# Altium project Arrax_testbench.PrjPcb (part 1 of 2)
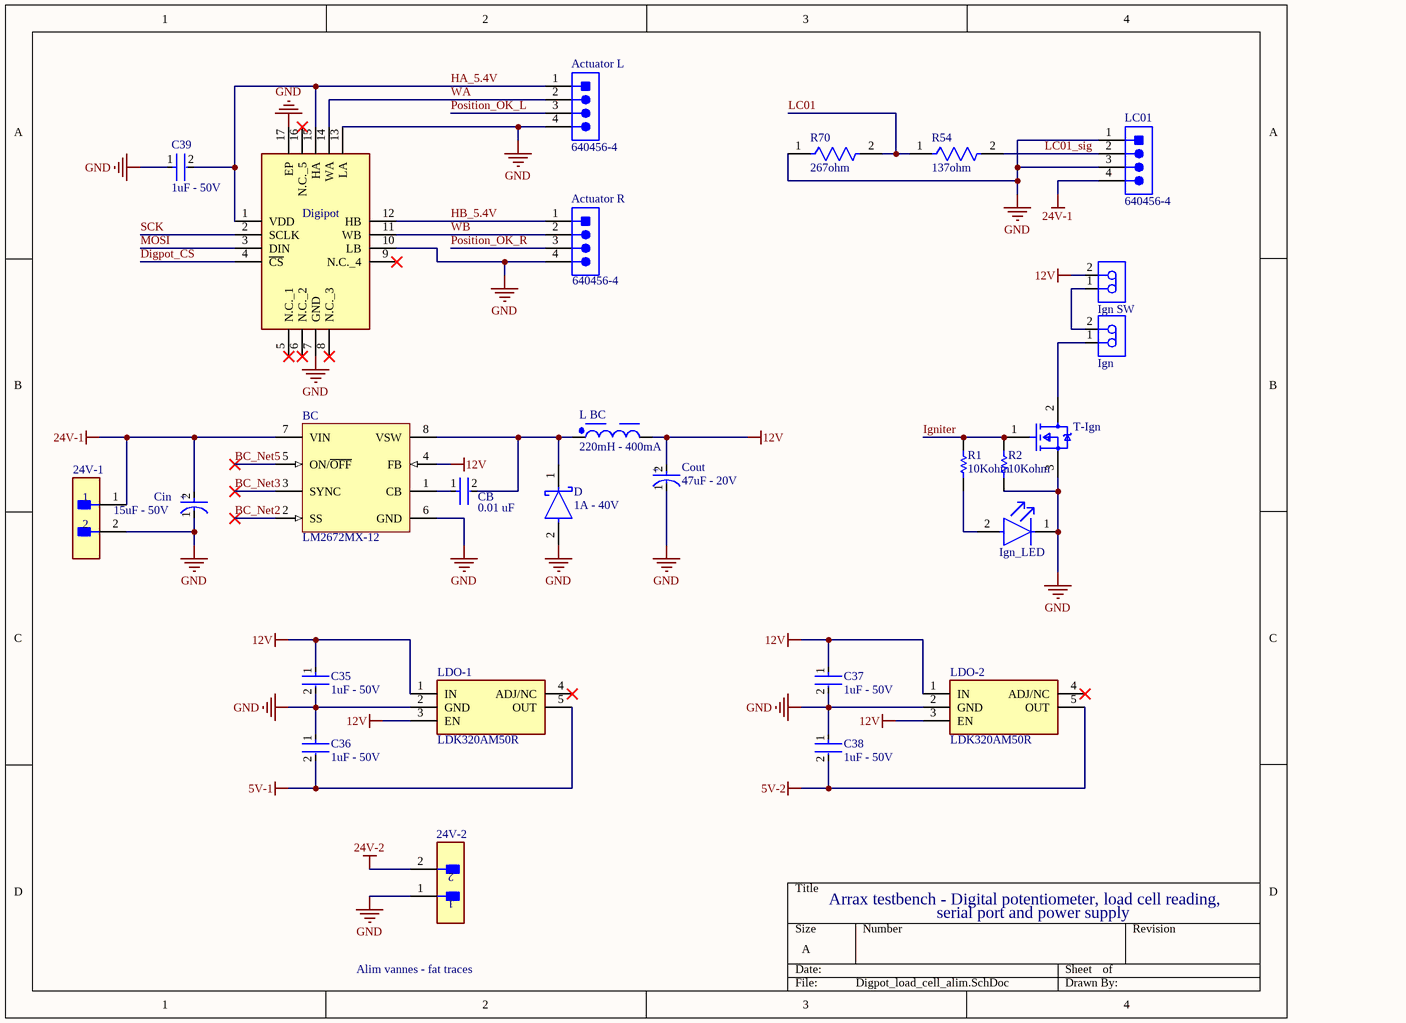
[diagram p0: Digpot_load_cell_alim.SchDoc]
7 sheets, 277 parts. Net scope: global (net labels, ports and power ports of the same name join across sheets).
Board file: Arrax_testbench_PCB_V1.PcbDoc
Sheets:
  Digpot_load_cell_alim.SchDoc
  Teensy_IOexp_valve_transitors.SchDoc
  Thermocouples.SchDoc
  Pressure_sensors.SchDoc
  Valve_transistors.SchDoc
  Thermocouples_1.SchDoc
  Flow_sensors.SchDoc

## Sheet Digpot_load_cell_alim.SchDoc
size A; SheetNumber: 1; SheetTotal: 7

### Parts
24V-1  (no value)  [FP-B2P-VH-FB-B_LF_SN-MFG]
24V-2  (no value)  [FP-B2P-VH-FB-B_LF_SN-MFG]
Actuator_L  640456-4  [TECO-640456-4]
Actuator_R  640456-4  [TECO-640456-4]
BC  LM2672MX-12  [M08A_L]
C35  1uF - 50V  [FP-0805-L_2_0_0_1-W_1_25-MFG]
C36  1uF - 50V  [FP-0805-L_2_0_0_1-W_1_25-MFG]
C37  1uF - 50V  [FP-0805-L_2_0_0_1-W_1_25-MFG]
C38  1uF - 50V  [FP-0805-L_2_0_0_1-W_1_25-MFG]
C39  1uF - 50V  [FP-0805-L_2_0_0_1-W_1_25-MFG]
CB  0.01 uF  [FP-CC0805-0_85-MFG]
Cin  15uF - 50V  [FP-TAJD-MFG]
Cout  47uF - 20V  [FP-TAJD-MFG]
D  1A - 40V  [FP-SOD-323-IPC_C]
Digipot  TPL0202-10MRTER  [QFN50P300X300X80-17N-D]  (value not drawn)
Ign  640456-2  [TECO-640456-2_V]  (value not drawn)
Ign_LED  LS R976-NR-1  [FP-LS_R976-MFG]  (value not drawn)
Ign_SW  640456-2  [TECO-640456-2_V]  (value not drawn)
L_BC  220mH - 400mA  [WE-LQFS_4828]
LC01  640456-4  [TECO-640456-4]
LDO-1  LDK320AM50R  [SOT95P280X145-5N]
LDO-2  LDK320AM50R  [SOT95P280X145-5N]
R1  10Kohm  [RESC2013X60X30NL20T20]
R2  10Kohm  [RESC2013X60X30NL20T20]
R54  137ohm  [FP-RP73P-2A-MFG]
R70  267ohm  [FP-RP73P-2A-MFG]
T-Ign  IRLZ44NPbF  [FP-PG-TO220-3-MFG]  (value not drawn)

### Nets
5V-1: C36.2 LDO-1.5(OUT)
5V-2: C38.2 LDO-2.5(OUT)
12V: BC.4(FB) C35.1 C37.1 Cout.2(A) Ign_SW.2 L_BC.2 LDO-1.1(IN) LDO-1.3(EN) LDO-2.1(IN) LDO-2.3(EN)
24V-1: 24V-1.1 BC.7(VIN) Cin.2(A) LC01.4
24V-2: 24V-2.2
GND: 24V-1.2 24V-2.1 Actuator_L.4 Actuator_R.4 BC.6(GND) C35.2 C36.1 C37.2 C38.1 C39.1 Cin.1(C) Cout.1(C) D.2(A) Digipot.7(GND) Digipot.10(LB) Digipot.13(LA) Digipot.17(EP) Ign_LED.1(C) LC01.1 LC01.3 LDO-1.2(GND) LDO-2.2(GND) R2.1 R70.1 T-Ign.3(S)
BC_Net2: BC.2(SS)
BC_Net3: BC.3(SYNC)
BC_Net5: BC.5(ON/~{OFF})
Digpot_CS: Digipot.4(~{CS})
HA_5.4V: Actuator_L.1 C39.2 Digipot.1(VDD) Digipot.15(HA)
HB_5.4V: Actuator_R.1 Digipot.12(HB)
Igniter: R1.2 R2.2 T-Ign.1(G)
LC01: R54.1 R70.2
LC01_sig: LC01.2 R54.2
MOSI: Digipot.3(DIN)
Position_OK_L: Actuator_L.3
Position_OK_R: Actuator_R.3
SCK: Digipot.2(SCLK)
WA: Actuator_L.2 Digipot.14(WA)
WB: Actuator_R.2 Digipot.11(WB)
NetBC_1: BC.1(CB) CB.1
NetBC_8: BC.8(VSW) CB.2 D.1(C) L_BC.1
NetIgn_1: Ign.1 T-Ign.2(D)
NetIgn_2: Ign.2 Ign_SW.1
NetIgn_LED_2: Ign_LED.2(A) R1.1

Not connected (* = marked no-connect by the designer): Digipot 5(N.C._1)* 6(N.C._2)* 8(N.C._3)* 9(N.C._4)* 16(N.C._5)*; LDO-1 4(ADJ/NC)*; LDO-2 4(ADJ/NC)*

### Notes on the sheet
- Arrax testbench - Digital potentiometer, load cell reading,
- Alim vannes - fat traces
- serial port and power supply
- (in symbol CMP-04424-000207-1) +
- (in symbol CMP-04424-000546-1) +

### Library data of the parts
24V-1 24V-2 = CMP-17439-000031-1: CONN HEADER VERT 2POS 3.96MM; Connector Type: Male Pin; Pitch: 0.156inch; Number of Positions: 2; Packaging: Bulk; Package Quantity: 250; Termination: Solder; Lead Free: Lead Free; Contact Plating: Tin; Contact Type: Male Pin; Color: Natural; Fastening Type: Ramp; Number of Rows: 1; Mount: Through Hole; Series: VH
Actuator_L Actuator_R LC01 = CMP-2000-05419-1: Male Header, Pitch 2.54 mm, 1 x 4 Position, Height 10.03 mm, Tail Length 3.56 mm, RoHS, Bulk; Manufacturer: TE Connectivity; Material, Housing: Polyester; Primary Type: InterconnectSystem; Mount Angle: Vertical; Color, Housing: White; Current, Rating: 5 / A; Agency Approvals: CSA,UL; Contact Termination Area Plating: Tin; Temperature, Operating: -55to+105 / degC; Standards: RoHSCompliant,ELVCompliant,UL94V-0; Number of Positions: 4; Brand/Series: MTA-100Series; Angle: Straight; Pin Spacing: 0.1 / "; Material, Contact: CopperAlloy; Connector Type: MTA-100; Special Features: Pinstrip; Mounting Hole Size: 0.04 / "; Contact Centerline Spacing: 0.100 / in.; Voltage, Rating: 250 / V; Manufacturer URL: http://www.te.com/; Length, Pin: 0.14 / "; Length, Overall: 0.4 / "; Color: White; Flammability Rating: UL94V-0; Mounting Type: PCMount; Termination: Solder; Datasheet URL: https://datasheet.ciiva.com/16286/eng-ds-82056-mta-0608-16286228.pdf; Number of Contacts: 4; Contact Shape: Square; Contact Mating Area Plating: Tin; Length, Terminal Post: 0.14 / in.; Size, Post: 0.025 / in.; Contact Plating: Tin; Type: PCBPlug; Datasheet Version: Dec-14; Number of Rows: 1
BC = CMP-0069-00660-2: SIMPLE SWITCHER® Power Converter High Efficiency 1A Step-Down Voltage Regulator with Features, 8-pin Narrow SOIC; Manufacturer: National Semiconductor; PackageTopMarking: NSZXTT*2672*M-12; PowerWise: N; ComponentLink2URL: http://www.national.com/pf/LM/LM2672.html; ComponentLink2Description: LM2672 Web Page; RoHS: N; PinCount: 8; Code_JEDEC: MS-012-AA; PackageDescription: SOIC Narrow, 4.9 x 3.9 x 1.45mm, 8 Lead, 1.27mm Pitch; PackageReference: M08A; ComponentLink3Description: M08A Package Page; RevisionNote: Component URLs added; Code_IPC: SOIC127P600-8; PackageVersion: revM, May-2009; ComponentLink1URL: http://www.national.com/ds/LM/LM2672.pdf; DatasheetVersion: Apr-2007; ComponentLink3URL: http://www.national.com/packaging/folders/m08a.html; ComponentLink1Description: LM2672 Datasheet; CompType: Switcher
C35-C39 = CMP-14477-005239-2: Multilayer Ceramic Capacitor 1 uF 50V X7R 10% SMD 0805 Automotive T/R; Packaging: Tape and Reel; Width: 1.2mm; Height: 1.25mm; Package Quantity: 3000; Min Operating Temperature: -55°C; Thickness: 0.053inch; Case/Package: 0805; Weight: 0.000194oz; Dielectric: X7R; Halogen Free: Halogen Free; Tolerance: 10%; Ratings: AEC-Q200; RoHS Compliant: Yes; Voltage Rating (DC): 50V; Capacitance: 1uF; Series: M; Length: 2mm; Mount: Surface Mount; Max Operating Temperature: 125°C; Voltage Rating: 50V; Case Code (Imperial): 0805; Case Code (Metric): 2012; Termination: SMD/SMT
CB = CMP-1036-03842-3: CAP CER 10000PF 50V X7R 0805; Manufacturer: Yageo; Manufacturer Part Number: CC0805KRX7R9BB103; Capacitance: 10 nF; Value: 10 nF; Tolerance: 0.1; Footprint Url: http://www.yageo.com/exep/pages/download/literatures/UPY-C_GEN_24.pdf; Material: Ceramic; Temperature Characteristic: X7R; ComponentLink2Description: Datasheet; Lead Free: Yes; Height: 0.95mm; Temperature Range High: +85°C; Automotive: No; Octopart: https://octopart.com/cc0805krx7r9bb103-yageo-192989; Device Class L1: Passive Components; Mouser Description: Multilayer Ceramic Capacitors MLCC - SMD/SMT 10nF 50V X7R 10%; Temperature: -30°C to +85°C; Device Class L2: Capacitors; Ipc Land Pattern Name: CAPC200125X85; Device Class L3: Ceramic Capacitors; Temperature Range Low: -30°C; RoHS: TRUE; Voltage Rating: 50 V; Package: CC0805-0.85; Category: Cap; ComponentLink2URL: http://www.yageo.com/documents/recent/UPY-GPHC_Y5V_6.3V-to-50V_8.pdf; Digikey Description: CAP CER 10000PF 50V X7R 0805
Cin = CMP-04424-000546-1: 15uF 50V  ±10% 600mΩ 2917  SMD Tantalum Capacitor; Leakage Current: 7.5uA; ESR (Equivalent Series Resistance): 600mR; Dissipation Factor: 6%; Polarity: Polar; RoHS Compliant: Yes; Packaging: Tape and Reel; Features: General Purpose; Dielectric Material: Tantalum; Case/Package: 2917; Case Code (Imperial): 2917; Max Operating Temperature: 125°C; Construction: Flat; Width: 0.169inch; Height - Seated (Max): 0.122inch; Lead Free: Lead Free; Capacitance: 15uF; Mount: Surface Mount; Depth: 4.3mm; Series: TAJ; Case Code (Metric): 7343; Voltage Rating: 50V; Termination: SMD/SMT; Min Operating Temperature: -55°C; Tolerance: 10%; Package Quantity: 500; Radiation Hardening: No; Height: 3.1mm; Length: 7.3mm; REACH SVHC: No SVHC; Lead Pitch: 4.4mm
Cout = CMP-04424-000207-1: 47uF 20V  ±10% 900mΩ 2917  SMD Tantalum Capacitor; Leakage Current: 9.4uA; Dissipation Factor: 6%; ESR (Equivalent Series Resistance): 900mR; Polarity: Polar; Width: 4.3mm; REACH SVHC: No SVHC; Voltage Rating (DC): 20V; RoHS Compliant: Yes; Height: 2.9mm; Case Code (Metric): 7343; Case Code (Imperial): 2917; Length: 7.3mm; Packaging: Tape and Reel; Series: TAJ; Lead Free: Lead Free; Voltage Rating: 20V; Max Operating Temperature: 125°C; Package Quantity: 1; Case/Package: 2917; Capacitance: 47uF; Tolerance: 10%; Dielectric Material: Tantalum; Depth: 4.3mm; Features: General Purpose; Min Operating Temperature: -55°C; Radiation Hardening: No; Height - Seated (Max): 0.122inch; Mount: Surface Mount; Voltage: 20V; Construction: Flat; Termination: SMD/SMT
D = CMP-56206-000009-1: DIODE SCHOTTKY 40V 1A SOD323; Max Reverse Leakage Current: 1mA; Peak Non-Repetitive Surge Current: 10A; Forward Voltage: 900mV; Element Configuration: Single; Max Reverse Voltage (DC): 40V; Number of Pins: 2; Max Operating Temperature: 125°C; Package Quantity: 1; Radiation Hardening: No; Average Rectified Current: 1A; Lead Free: Lead Free; Series: -; Mount: Surface Mount; Min Operating Temperature: -65°C; RoHS Compliant: Yes; Packaging: Tape and Reel; Max Surge Current: 10A
Digipot = TPL0202-10MRTER: Integrated Circuit; Manufacturer_Name: Texas Instruments; Datasheet Link: http://www.ti.com/lit/gpn/tpl0202-10; Height: 0.8mm; Manufacturer_Part_Number: TPL0202-10MRTER; Mouser Part Number: 595-TPL0202-10MRTER; Mouser Price/Stock: https://www.mouser.co.uk/ProductDetail/Texas-Instruments/TPL0202-10MRTER?qs=O1HRStiETCjiIaUc6hg4xg%3D%3D; Arrow Part Number: TPL0202-10MRTER; Arrow Price/Stock: https://www.arrow.com/en/products/tpl0202-10mrter/texas-instruments
Ign Ign_SW = CMP-2000-05417-1: Male Header, Pitch 2.54 mm, 1 x 2 Position, Height 10.49 mm, Tail Length 3.556 mm, -55 to 105 degC, RoHS, Bulk; Manufacturer: TE Connectivity; Standards: RoHSCompliant,ELVCompliant,UL94V-0; Material, Housing: Polyester; Agency Approvals: CSA,UL; Brand/Series: MTA-100Series; Contact Centerline Spacing: 0.100 / in.; Material, Contact: CopperAlloy; Current, Rating: 5 / A; Color, Housing: White; Contact Termination Area Plating: Tin; Special Features: Pinstrip; Number of Positions: 2; Pin Spacing: 0.1 / "; Temperature, Operating: -55to+105 / degC; Angle: Straight; Mount Angle: Vertical; Connector Type: MTA-100; Primary Type: InterconnectSystem; Voltage, Rating: 250 / V; Mounting Hole Size: 0.04 / "; Number of Rows: 1; Termination: Solder; Length, Terminal Post: 0.14 / in.; Manufacturer URL: http://www.te.com/; Color: White; Size, Post: 0.025 / in.; Contact Shape: Square; Mounting Type: PCMount; Datasheet URL: https://datasheet.ciiva.com/11746/0900766b80eb7fdd-11746365.pdf; Type: PCBPlug; Datasheet Version: Rev. W, 06/2004; Number of Contacts: 2; Flammability Rating: UL94V-0; Contact Plating: Tin; Length, Pin: 0.14 / "; Contact Mating Area Plating: Tin; Length, Overall: 0.2 / "
Ign_LED = CMP-62016-000037-1: LED RED DIFFUSED 0805 SMD; Lens Size: 1.25mm; Number of LEDs: 1; Luminous Intensity: 180mcd; Dominant Wavelength: 633nm; Lens Style: Flat; Reverse Voltage: 12V; Lens Color: White; Forward Voltage: 2.5V; Forward Current: 25mA; Power Dissipation: 65W; Luminous Flux: 0.47lm; Test Current: 20mA; Viewing Angle: 160°; Length: 2mm; Number of Pins: 2; Lens Transparency: Diffused; Min Operating Temperature: -30°C; Case Code (Metric): 2012; Depth: 1.35mm; Color: Red; Illumination Color: Red; Max Operating Temperature: 85°C; Mount: Surface Mount; Case/Package: 0805; Height: 0.9mm; Package Quantity: 16000; Number of Elements: 1; Radiation Hardening: No; Case Code (Imperial): 0805; Packaging: Tape and Reel; Width: 1.25mm
L_BC = CMP-03913-77814927-1: 74406043221 Fixed Ind 220UH 400MA 1.326 Ohm; DC Resistance (DCR): 1.105Ω; Inductance Tolerance: 20%; Inductance: 220µH; RoHS: Compliant; Ambient Temperature Range High: 85°C; Ambient Temperature Range Low: -40°C; Min Operating Temperature: -40°C; Length: 4.8mm; Current Rating: 400mA; NexarPartId: 77814927; Height: 2.8mm; Width: 4.8mm; Max Operating Temperature: 125°C
LDO-1 LDO-2 = LDK320AM50R: Integrated Circuit; Manufacturer_Name: STMicroelectronics; Datasheet Link: http://www.st.com/resource/en/datasheet/ldk320.pdf; Height: 1.45mm; Manufacturer_Part_Number: LDK320AM50R; Mouser Part Number: 511-LDK320AM50R; Mouser Price/Stock: https://www.mouser.co.uk/ProductDetail/STMicroelectronics/LDK320AM50R?qs=dTJS0cRn7ohMsVcu3TlL4w%3D%3D; Arrow Part Number: LDK320AM50R; Arrow Price/Stock: https://www.arrow.com/en/products/ldk320am50r/stmicroelectronics?region=nac
R1 R2 = CMP-2001-01994-1: Manufacturer: KOA Speer; Part Number: RK73H2ATTD1003F
R54 = CMP-03211-001043-1: RP73P 0805 137Ω 0.25W 25ppm/°C 0.10% 150V; Manufacturer Part Number: RP73PF2A137RBTDF; Manufacturer: TE Connectivity; Tolerance: 0.001; Temperature Coefficient: 25ppm/°C; Composition: Thin Film; Temperature Range High: +155°C; Automotive: No; Ipc Land Pattern Name: RESC200125X55; Lead Free: Yes; Device Class L2: Resistors; Temperature: -55°C to +155°C; Resistance: 137Ω; Series: RP73P; Category: Res; Temperature Range Low: -55°C; RoHS: TRUE; Voltage Rating: 150V; Value: 137Ω; Height: 0.65mm; ComponentLink2URL: https://www.te.com/commerce/DocumentDelivery/DDEController?Action=srchrtrv&DocNm=1773272&DocType=DS&DocLang=English; Package: RP73P-2A; Power Rating: 0.25W; ComponentLink2Description: Datasheet; Device Class L1: Passive Components; Device Class L3: Chip SMD Resistors; Octopart: https://octopart.com/rp73pf2a137rbtdf-te+connectivity-45466427
R70 = CMP-03211-003395-1: RP73P 0805 267Ω 0.25W 25ppm/°C 0.10% 150V; Manufacturer Part Number: RP73PF2A267RBTDF; Manufacturer: TE Connectivity; Tolerance: 0.001; RoHS: TRUE; Composition: Thin Film; Device Class L1: Passive Components; Temperature Coefficient: 25ppm/°C; Height: 0.65mm; Temperature Range Low: -55°C; Category: Res; Temperature Range High: +155°C; Value: 267Ω; Device Class L2: Resistors; Lead Free: Yes; ComponentLink2Description: Datasheet; ComponentLink2URL: https://www.te.com/commerce/DocumentDelivery/DDEController?Action=srchrtrv&DocNm=1773272&DocType=DS&DocLang=English; Device Class L3: Chip SMD Resistors; Voltage Rating: 150V; Power Rating: 0.25W; Automotive: No; Series: RP73P; Ipc Land Pattern Name: RESC200125X55; Package: RP73P-2A; Temperature: -55°C to +155°C; Octopart: https://octopart.com/rp73pf2a267rbtdf-te+connectivity-45466701; Resistance: 267Ω
T-Ign = CMP-32901-000488-1: MOSFET N-CH 55V 47A TO220AB; Turn-On Delay Time: 11ns; Gate to Source Voltage (Vgs): 16V; Element Configuration: Single; Rds On Max: 22mR; Turn-Off Delay Time: 26ns; Max Power Dissipation: 110W; Threshold Voltage: 2V; Drain to Source Resistance: 35mR; Input Capacitance: 1.7nF; Continuous Drain Current (ID): 47A; Case/Package: TO-220; Lead Free: Lead Free; Halogen Free: Halogen Free; Packaging: Rail/Tube; Length: 0.414inch; Min Operating Temperature: -55°C; REACH SVHC: No SVHC; Number of Pins: 3; Width: 0.185inch; Drain to Source Voltage (Vdss): 55V; Power Dissipation: 110W; RoHS Compliant: Yes; Max Operating Temperature: 175°C; Height: 0.6inch; Max Dual Supply Voltage: 55V; Drain to Source Breakdown Voltage: 55V; Mount: Through Hole

## Sheet Teensy_IOexp_valve_transitors.SchDoc
size A; SheetNumber: 2; SheetTotal: 7
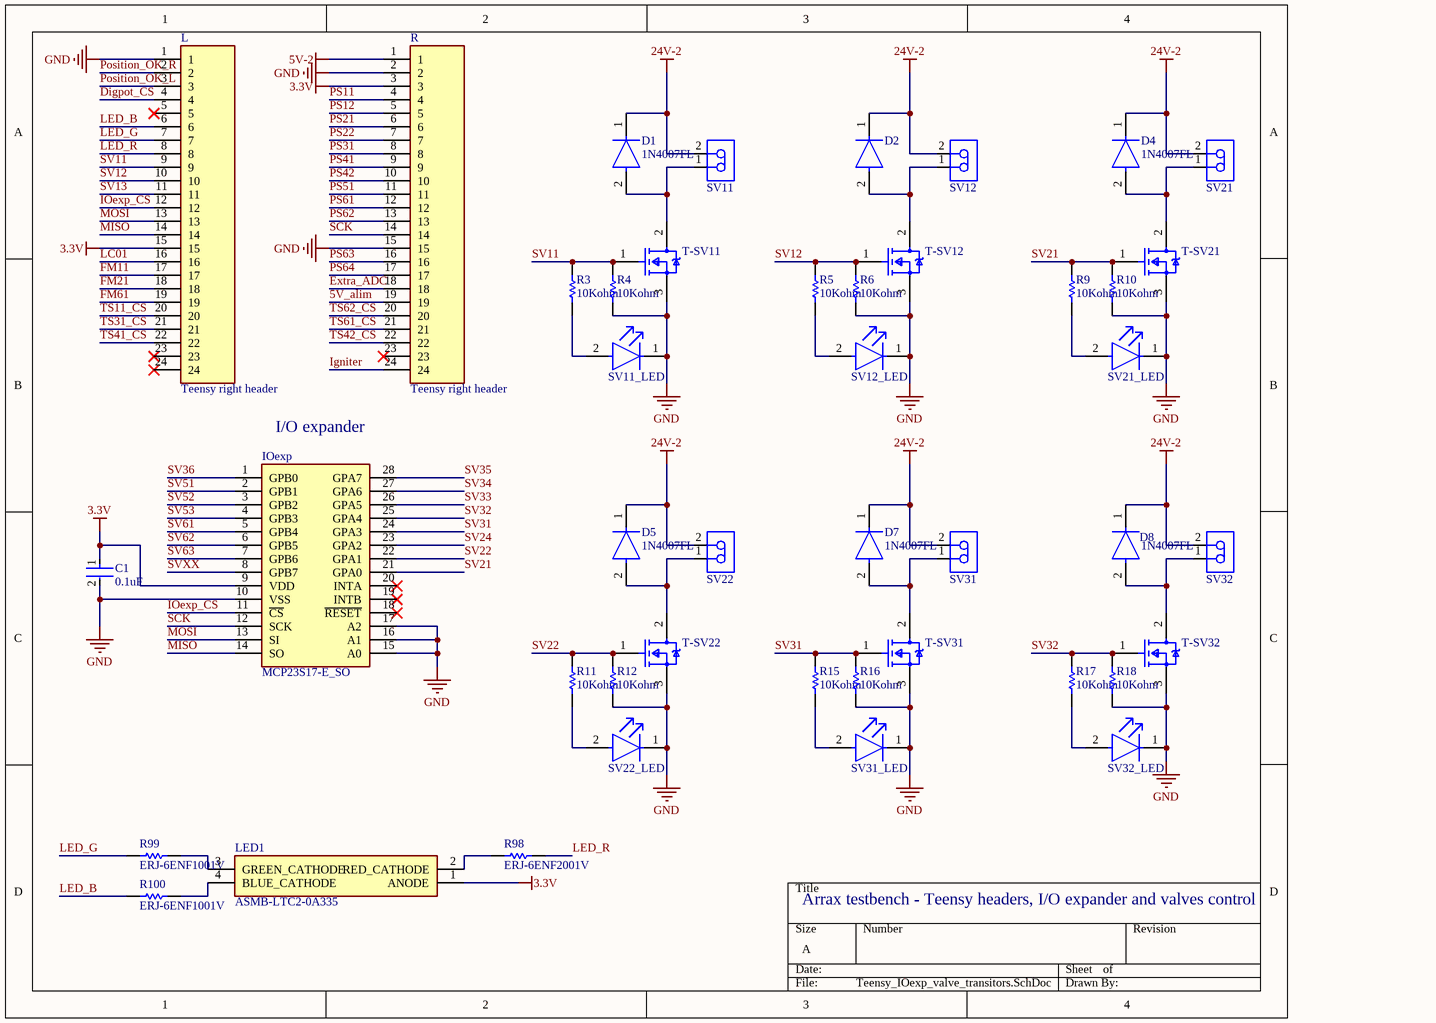
[diagram p1: Teensy_IOexp_valve_transitors.SchDoc]

### Parts
C1  0.1uF  [FP-CC0805-0_85-MFG]
D1  1N4007FL  [FP-1N4007FL-MFG]
D2  1N4007FL  [FP-1N4007FL-MFG]  (value not drawn)
D4  1N4007FL  [FP-1N4007FL-MFG]
D5  1N4007FL  [FP-1N4007FL-MFG]
D7  1N4007FL  [FP-1N4007FL-MFG]
D8  1N4007FL  [FP-1N4007FL-MFG]
IOexp  MCP23S17-E_SO  [SOIC127P1030X265-28N]
L  Teensy right header  [RHDR24W80P254X254_1X24_6146X254X850P]
LED1  ASMB-LTC2-0A335  [ASMBLTC20A335]
R  Teensy right header  [RHDR24W80P254X254_1X24_6146X254X850P]
R3  10Kohm  [RESC2013X60X30NL20T20]
R4  10Kohm  [RESC2013X60X30NL20T20]
R5  10Kohm  [RESC2013X60X30NL20T20]
R6  10Kohm  [RESC2013X60X30NL20T20]
R9  10Kohm  [RESC2013X60X30NL20T20]
R10  10Kohm  [RESC2013X60X30NL20T20]
R11  10Kohm  [RESC2013X60X30NL20T20]
R12  10Kohm  [RESC2013X60X30NL20T20]
R15  10Kohm  [RESC2013X60X30NL20T20]
R16  10Kohm  [RESC2013X60X30NL20T20]
R17  10Kohm  [RESC2013X60X30NL20T20]
R18  10Kohm  [RESC2013X60X30NL20T20]
R98  ERJ-6ENF2001V  [RESC2013X70X40NL20T20]
R99  ERJ-6ENF1001V  [RESC2013X70X40ML20T20]
R100  ERJ-6ENF1001V  [RESC2013X70X40ML20T20]
SV11  640456-2  [TECO-640456-2_V]  (value not drawn)
SV11_LED  LS R976-NR-1  [FP-LS_R976-MFG]  (value not drawn)
SV12  640456-2  [TECO-640456-2_V]  (value not drawn)
SV12_LED  LS R976-NR-1  [FP-LS_R976-MFG]  (value not drawn)
SV21  640456-2  [TECO-640456-2_V]  (value not drawn)
SV21_LED  LS R976-NR-1  [FP-LS_R976-MFG]  (value not drawn)
SV22  640456-2  [TECO-640456-2_V]  (value not drawn)
SV22_LED  LS R976-NR-1  [FP-LS_R976-MFG]  (value not drawn)
SV31  640456-2  [TECO-640456-2_V]  (value not drawn)
SV31_LED  LS R976-NR-1  [FP-LS_R976-MFG]  (value not drawn)
SV32  640456-2  [TECO-640456-2_V]  (value not drawn)
SV32_LED  LS R976-NR-1  [FP-LS_R976-MFG]  (value not drawn)
T-SV11  IRLZ44NPbF  [FP-PG-TO220-3-MFG]  (value not drawn)
T-SV12  IRLZ44NPbF  [FP-PG-TO220-3-MFG]  (value not drawn)
T-SV21  IRLZ44NPbF  [FP-PG-TO220-3-MFG]  (value not drawn)
T-SV22  IRLZ44NPbF  [FP-PG-TO220-3-MFG]  (value not drawn)
T-SV31  IRLZ44NPbF  [FP-PG-TO220-3-MFG]  (value not drawn)
T-SV32  IRLZ44NPbF  [FP-PG-TO220-3-MFG]  (value not drawn)

### Nets
3.3V: C1.1 IOexp.9(VDD) L.15 LED1.1(ANODE) R.3
5V-2: R.1
24V-2: D1.1(C) D2.1(C) D4.1(C) D5.1(C) D7.1(C) D8.1(C) SV11.2 SV12.2 SV21.2 SV22.2 SV31.2 SV32.2
GND: C1.2 IOexp.10(VSS) IOexp.15(A0) IOexp.16(A1) IOexp.17(A2) L.1 R.2 R.15 R4.1 R6.1 R10.1 R12.1 R16.1 R18.1 SV11_LED.1(C) SV12_LED.1(C) SV21_LED.1(C) SV22_LED.1(C) SV31_LED.1(C) SV32_LED.1(C) T-SV11.3(S) T-SV12.3(S) T-SV21.3(S) T-SV22.3(S) T-SV31.3(S) T-SV32.3(S)
5V_alim: R.19
Digpot_CS: L.4
Extra_ADC: R.18
FM11: L.17
FM21: L.18
FM61: L.19
Igniter: R.24
IOexp_CS: IOexp.11(~{CS}) L.12
LC01: L.16
LED_B: L.6 R100.1
LED_G: L.7 R99.1
LED_R: L.8 R98.2
MISO: IOexp.14(SO) L.14
MOSI: IOexp.13(SI) L.13
Position_OK_L: L.3
Position_OK_R: L.2
PS11: R.4
PS12: R.5
PS21: R.6
PS22: R.7
PS31: R.8
PS41: R.9
PS42: R.10
PS51: R.11
PS61: R.12
PS62: R.13
PS63: R.16
PS64: R.17
SCK: IOexp.12(SCK) R.14
SV11: L.9 R3.2 R4.2 T-SV11.1(G)
SV12: L.10 R5.2 R6.2 T-SV12.1(G)
SV13: L.11
SV21: IOexp.21(GPA0) R9.2 R10.2 T-SV21.1(G)
SV22: IOexp.22(GPA1) R11.2 R12.2 T-SV22.1(G)
SV24: IOexp.23(GPA2)
SV31: IOexp.24(GPA3) R15.2 R16.2 T-SV31.1(G)
SV32: IOexp.25(GPA4) R17.2 R18.2 T-SV32.1(G)
SV33: IOexp.26(GPA5)
SV34: IOexp.27(GPA6)
SV35: IOexp.28(GPA7)
SV36: IOexp.1(GPB0)
SV51: IOexp.2(GPB1)
SV52: IOexp.3(GPB2)
SV53: IOexp.4(GPB3)
SV61: IOexp.5(GPB4)
SV62: IOexp.6(GPB5)
SV63: IOexp.7(GPB6)
SVXX: IOexp.8(GPB7)
TS11_CS: L.20
TS31_CS: L.21
TS41_CS: L.22
TS42_CS: R.22
TS61_CS: R.21
TS62_CS: R.20
NetD1_2: D1.2(A) SV11.1 T-SV11.2(D)
NetD2_2: D2.2(A) SV12.1 T-SV12.2(D)
NetD4_2: D4.2(A) SV21.1 T-SV21.2(D)
NetD5_2: D5.2(A) SV22.1 T-SV22.2(D)
NetD7_2: D7.2(A) SV31.1 T-SV31.2(D)
NetD8_2: D8.2(A) SV32.1 T-SV32.2(D)
NetLED1_2: LED1.2(RED_CATHODE) R98.1
NetLED1_3: LED1.3(GREEN_CATHODE) R99.2
NetLED1_4: LED1.4(BLUE_CATHODE) R100.2
NetR3_1: R3.1 SV11_LED.2(A)
NetR5_1: R5.1 SV12_LED.2(A)
NetR9_1: R9.1 SV21_LED.2(A)
NetR11_1: R11.1 SV22_LED.2(A)
NetR15_1: R15.1 SV31_LED.2(A)
NetR17_1: R17.1 SV32_LED.2(A)

Not connected (* = marked no-connect by the designer): IOexp 18(~{RESET})* 19(INTB)* 20(INTA)*; L 5* 23* 24*; R 23*

### Notes on the sheet
- I/O expander
- Arrax testbench - Teensy headers, I/O expander and valves control

### Library data of the parts
C1 = CMP-2100-03606-3: CAP CER 0.1UF 50V X7R 0805; Manufacturer Part Number: CC0805KRX7R9BB104; Manufacturer: Yageo; Tolerance: 0.1; Capacitance: 100 nF; Value: 100 nF; Material: Ceramic; Device Class L1: Passive Components; ComponentLink2Description: Datasheet; Package: CC0805-0.85; Digikey Description: CAP CER 0.1UF 50V X7R 0805; Device Class L3: Ceramic Capacitors; Temperature: -30°C to +85°C; Temperature Characteristic: X7R; Voltage Rating: 50 V; Height: 0.95mm; RoHS: TRUE; Ipc Land Pattern Name: CAPC200125X85; Device Class L2: Capacitors; Category: Cap; Temperature Range Low: -30°C; Temperature Range High: +85°C; Mouser Description: Multilayer Ceramic Capacitors MLCC - SMD/SMT 100nF 50V X7R 10%; Footprint Url: http://www.yageo.com/exep/pages/download/literatures/UPY-C_GEN_24.pdf; Automotive: No; Octopart: https://octopart.com/cc0805krx7r9bb104-yageo-192993; Lead Free: Yes; ComponentLink2URL: http://www.yageo.com/documents/recent/UPY-GPHC_Y5V_6.3V-to-50V_8.pdf
D1 D2 D4 D5 D7 D8 = CMP-10078-122641204-1: 1N4007FL Diode Gen Purp 1KV 1A SOD123FL; Capacitance: 6pF; Max Junction Temperature (Tj): 150°C; Peak Reverse Current: 5µA; Max Forward Surge Current (Ifsm): 30A; Reverse Voltage: 1kV; Max Operating Temperature: 150°C; Height: 1.1mm; Min Operating Temperature: -55°C; Forward Current: 1A; Max Repetitive Reverse Voltage (Vrrm): 1kV; NexarPartId: 122641204
IOexp = MCP23S17-E_SO: Integrated Circuit; Manufacturer_Name: Microchip; Manufacturer_Part_Number: MCP23S17-E/SO; Datasheet Link: https://datasheet.datasheetarchive.com/originals/distributors/SFDatasheet-4/sf-00090057.pdf; Height: 2.65mm; Mouser Part Number: 579-MCP23S17-E/SO; Mouser Price/Stock: https://www.mouser.co.uk/ProductDetail/Microchip-Technology/MCP23S17-E-SO?qs=usxtMOJb1RzJScThsWtScg%3D%3D; Arrow Part Number: MCP23S17-E/SO; Arrow Price/Stock: https://www.arrow.com/en/products/mcp23s17-eso/microchip-technology?region=europe
L R = PPTC241LFBN-RC: Connector; Manufacturer_Name: Sullins; Datasheet Link: https://drawings-pdf.s3.amazonaws.com/10492.pdf; Height: 8.5mm; Manufacturer_Part_Number: PPTC241LFBN-RC
LED1 = ASMB-LTC2-0A335: LED; Manufacturer_Name: Avago Technologies; Datasheet Link: https://datasheet.datasheetarchive.com/originals/distributors/Datasheets_SAMA/7bf4059288332b456b15eab80a49c995.pdf; Height: 1.2mm; Manufacturer_Part_Number: ASMB-LTC2-0A335
R3-R6 R9-R12 R15-R18 = CMP-2001-01994-1: as R1 on sheet Digpot_load_cell_alim
R98 = CMP-2001-00026-5: Chip Resistor, 2 KOhm, +/- 1%, 0.125 W, -55 to 155 degC, 0805 (2012 Metric), RoHS, Tape and Reel; Manufacturer: Panasonic; Voltage Rating: 150 V; RoHSCompliant: true; Packaging: Tape and Reel; ComponentLink2Description: Datasheet; DatasheetVersion: 04/2015; Min Operating Temperature: -55 degC; Max Operating Temperature: 155 degC; Mounting Technology: Surface Mount; Length: 2 mm; Package Quantity: 5000; REACH SVHC: Unknown; ComponentLink1URL: http://www.panasonic.com/; ComponentLink2URL: http://industrial.panasonic.com/cdbs/www-data/pdf/RDA0000/AOA0000C86.pdf; Mount: Surface Mount; PackageReference: 0805; ComponentLink1Description: Manufacturer URL; PackageDescription: 2-Pin Surface Mount Device, Body 2 x 1.25 mm; Height: 0.6 mm
R99 R100 = CMP-2001-04375-5: Chip Resistor, 1 KOhm, +/- 1%, 0.125 W, -55 to 155 degC, 0805 (2012 Metric), RoHS, Tape and Reel; Manufacturer: Panasonic; Voltage Rating: 150 V; ComponentLink1URL: http://www.panasonic.com/; ComponentLink2Description: Datasheet; REACH SVHC: Yes; ComponentLink1Description: Manufacturer URL; Length: 2 mm; Height: 0.6 mm; Package Quantity: 1; PackageDescription: 2-Pin Surface Mount Device, Body 2 x 1.25 mm; Packaging: Cut Tape; PackageReference: 0805; Max Operating Temperature: 155 degC; Mounting Technology: Surface Mount; ComponentLink2URL: http://industrial.panasonic.com/cdbs/www-data/pdf/RDA0000/AOA0000C86.pdf; DatasheetVersion: 04/2015; Min Operating Temperature: -55 degC; RoHSCompliant: true; Mount: Surface Mount
SV11 SV12 SV21 SV22 SV31 SV32 = CMP-2000-05417-1: as Ign on sheet Digpot_load_cell_alim; Number of Rows: 1; Termination: Solder; Length, Terminal Post: 0.14 / in.; Manufacturer URL: http://www.te.com/; Color: White; Size, Post: 0.025 / in.; Contact Shape: Square; Mounting Type: PCMount; Datasheet URL: https://datasheet.ciiva.com/11746/0900766b80eb7fdd-11746365.pdf; Type: PCBPlug; Datasheet Version: Rev. W, 06/2004; Number of Contacts: 2; Flammability Rating: UL94V-0; Contact Plating: Tin; Length, Pin: 0.14 / "; Contact Mating Area Plating: Tin; Length, Overall: 0.2 / "
SV11_LED SV12_LED SV21_LED SV22_LED SV31_LED SV32_LED = CMP-62016-000037-1: as Ign_LED on sheet Digpot_load_cell_alim; Length: 2mm; Number of Pins: 2; Lens Transparency: Diffused; Min Operating Temperature: -30°C; Case Code (Metric): 2012; Depth: 1.35mm; Color: Red; Illumination Color: Red; Max Operating Temperature: 85°C; Mount: Surface Mount; Case/Package: 0805; Height: 0.9mm; Package Quantity: 16000; Number of Elements: 1; Radiation Hardening: No; Case Code (Imperial): 0805; Packaging: Tape and Reel; Width: 1.25mm
T-SV11 T-SV12 T-SV21 T-SV22 T-SV31 T-SV32 = CMP-32901-000488-1: as T-Ign on sheet Digpot_load_cell_alim; Continuous Drain Current (ID): 47A; Case/Package: TO-220; Lead Free: Lead Free; Halogen Free: Halogen Free; Packaging: Rail/Tube; Length: 0.414inch; Min Operating Temperature: -55°C; REACH SVHC: No SVHC; Number of Pins: 3; Width: 0.185inch; Drain to Source Voltage (Vdss): 55V; Power Dissipation: 110W; RoHS Compliant: Yes; Max Operating Temperature: 175°C; Height: 0.6inch; Max Dual Supply Voltage: 55V; Drain to Source Breakdown Voltage: 55V; Mount: Through Hole

## Sheet Thermocouples.SchDoc
size A; SheetNumber: 3; SheetTotal: 7
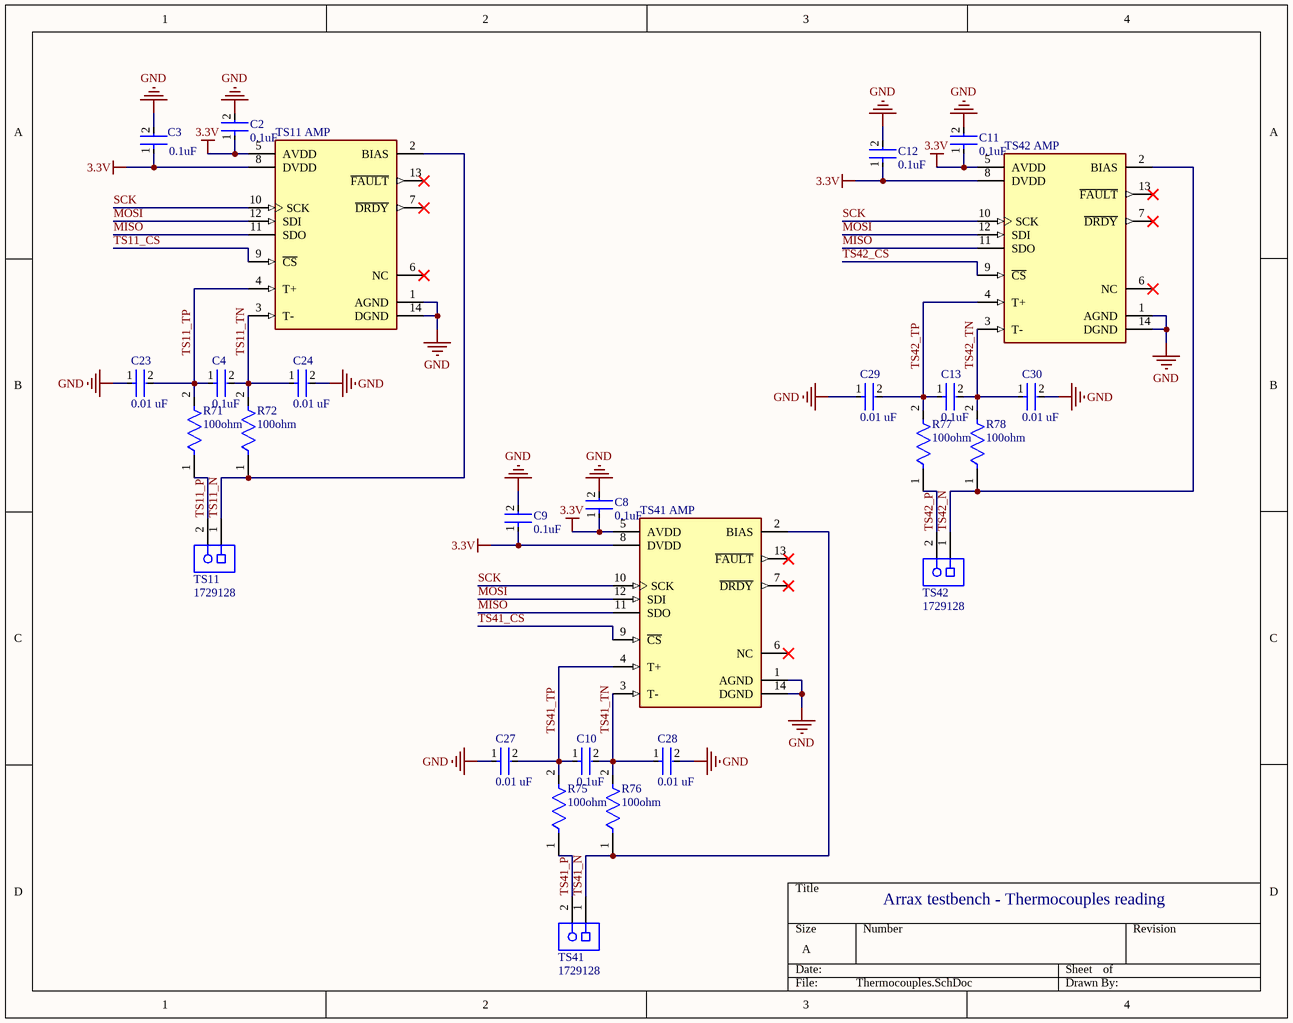
[diagram p2: Thermocouples.SchDoc]

### Parts
C2  0.1uF  [FP-CC0805-0_85-MFG]
C3  0.1uF  [FP-CC0805-0_85-MFG]
C4  0.1uF  [FP-CC0805-0_85-MFG]
C8  0.1uF  [FP-CC0805-0_85-MFG]
C9  0.1uF  [FP-CC0805-0_85-MFG]
C10  0.1uF  [FP-CC0805-0_85-MFG]
C11  0.1uF  [FP-CC0805-0_85-MFG]
C12  0.1uF  [FP-CC0805-0_85-MFG]
C13  0.1uF  [FP-CC0805-0_85-MFG]
C23  0.01 uF  [FP-CC0805-0_85-MFG]
C24  0.01 uF  [FP-CC0805-0_85-MFG]
C27  0.01 uF  [FP-CC0805-0_85-MFG]
C28  0.01 uF  [FP-CC0805-0_85-MFG]
C29  0.01 uF  [FP-CC0805-0_85-MFG]
C30  0.01 uF  [FP-CC0805-0_85-MFG]
R71  100ohm  [FP-RMCF0805-IPC_A]
R72  100ohm  [FP-RMCF0805-IPC_A]
R75  100ohm  [FP-RMCF0805-IPC_A]
R76  100ohm  [FP-RMCF0805-IPC_A]
R77  100ohm  [FP-RMCF0805-IPC_A]
R78  100ohm  [FP-RMCF0805-IPC_A]
TS11  1729128  [PHOE-1729128-2_V]
TS11_AMP  (no value)  [FP-U14-2-MFG]
TS41  1729128  [PHOE-1729128-2_V]
TS41_AMP  (no value)  [FP-U14-2-MFG]
TS42  1729128  [PHOE-1729128-2_V]
TS42_AMP  (no value)  [FP-U14-2-MFG]

### Nets
3.3V: C2.1 C3.1 C8.1 C9.1 C11.1 C12.1 TS11_AMP.5(AVDD) TS11_AMP.8(DVDD) TS41_AMP.5(AVDD) TS41_AMP.8(DVDD) TS42_AMP.5(AVDD) TS42_AMP.8(DVDD)
GND: C2.2 C3.2 C8.2 C9.2 C11.2 C12.2 C23.1 C24.2 C27.1 C28.2 C29.1 C30.2 TS11_AMP.1(AGND) TS11_AMP.14(DGND) TS41_AMP.1(AGND) TS41_AMP.14(DGND) TS42_AMP.1(AGND) TS42_AMP.14(DGND)
MISO: TS11_AMP.11(SDO) TS41_AMP.11(SDO) TS42_AMP.11(SDO)
MOSI: TS11_AMP.12(SDI) TS41_AMP.12(SDI) TS42_AMP.12(SDI)
SCK: TS11_AMP.10(SCK) TS41_AMP.10(SCK) TS42_AMP.10(SCK)
TS11_CS: TS11_AMP.9(~{CS})
TS11_N: R72.1 TS11.1 TS11_AMP.2(BIAS)
TS11_P: R71.1 TS11.2
TS11_TN: C4.2 C24.1 R72.2 TS11_AMP.3(T-)
TS11_TP: C4.1 C23.2 R71.2 TS11_AMP.4(T+)
TS41_CS: TS41_AMP.9(~{CS})
TS41_N: R76.1 TS41.1 TS41_AMP.2(BIAS)
TS41_P: R75.1 TS41.2
TS41_TN: C10.2 C28.1 R76.2 TS41_AMP.3(T-)
TS41_TP: C10.1 C27.2 R75.2 TS41_AMP.4(T+)
TS42_CS: TS42_AMP.9(~{CS})
TS42_N: R78.1 TS42.1 TS42_AMP.2(BIAS)
TS42_P: R77.1 TS42.2
TS42_TN: C13.2 C30.1 R78.2 TS42_AMP.3(T-)
TS42_TP: C13.1 C29.2 R77.2 TS42_AMP.4(T+)

Not connected (* = marked no-connect by the designer): TS11_AMP 6(NC)* 7(~{DRDY})* 13(~{FAULT})*; TS41_AMP 6(NC)* 7(~{DRDY})* 13(~{FAULT})*; TS42_AMP 6(NC)* 7(~{DRDY})* 13(~{FAULT})*

### Notes on the sheet
- Arrax testbench - Thermocouples reading

### Library data of the parts
C2-C4 C8-C13 = CMP-2100-03606-3: as C1 on sheet Teensy_IOexp_valve_transitors; Device Class L1: Passive Components; ComponentLink2Description: Datasheet; Package: CC0805-0.85; Digikey Description: CAP CER 0.1UF 50V X7R 0805; Device Class L3: Ceramic Capacitors; Temperature: -30°C to +85°C; Temperature Characteristic: X7R; Voltage Rating: 50 V; Height: 0.95mm; RoHS: TRUE; Ipc Land Pattern Name: CAPC200125X85; Device Class L2: Capacitors; Category: Cap; Temperature Range Low: -30°C; Temperature Range High: +85°C; Mouser Description: Multilayer Ceramic Capacitors MLCC - SMD/SMT 100nF 50V X7R 10%; Footprint Url: http://www.yageo.com/exep/pages/download/literatures/UPY-C_GEN_24.pdf; Automotive: No; Octopart: https://octopart.com/cc0805krx7r9bb104-yageo-192993; Lead Free: Yes; ComponentLink2URL: http://www.yageo.com/documents/recent/UPY-GPHC_Y5V_6.3V-to-50V_8.pdf
C23 C24 C27-C30 = CMP-1036-03842-3: CAP CER 10000PF 50V X7R 0805; Manufacturer: Yageo; Manufacturer Part Number: CC0805KRX7R9BB103; Capacitance: 10 nF; Material: Ceramic; Value: 10 nF; Tolerance: 0.1; Footprint Url: http://www.yageo.com/exep/pages/download/literatures/UPY-C_GEN_24.pdf; Temperature Characteristic: X7R; ComponentLink2Description: Datasheet; Lead Free: Yes; Height: 0.95mm; Temperature Range High: +85°C; Automotive: No; Octopart: https://octopart.com/cc0805krx7r9bb103-yageo-192989; Device Class L1: Passive Components; Mouser Description: Multilayer Ceramic Capacitors MLCC - SMD/SMT 10nF 50V X7R 10%; Temperature: -30°C to +85°C; Device Class L2: Capacitors; Ipc Land Pattern Name: CAPC200125X85; Device Class L3: Ceramic Capacitors; Temperature Range Low: -30°C; RoHS: TRUE; Voltage Rating: 50 V; Package: CC0805-0.85; Category: Cap; ComponentLink2URL: http://www.yageo.com/documents/recent/UPY-GPHC_Y5V_6.3V-to-50V_8.pdf; Digikey Description: CAP CER 10000PF 50V X7R 0805
R71 R72 R75-R78 = CMP-26527-001731-1: 100Ω ±1% 0.125W 0805 Thick Film Chip Resistor AEC-Q200 compliant; Power Rating: 250mW; Temperature Coefficient: 100ppm/°C; Resistance: 100R; Max Power Dissipation: 125mW; Radiation Hardening: No; RoHS Compliant: Yes; Case Code (Imperial): 0805; Depth: 1.25mm; Length: 2mm; Min Operating Temperature: -55°C; Series: RMCF; Packaging: Tape and Reel; Features: Automotive AEC-Q200; Height: 0.026inch; Size Code: 0805; Tolerance: 1%; Number of Terminations: 2; Max Operating Temperature: 155°C; Case/Package: 0805; Width: 0.049inch; Contact Plating: Tin; Resistor Type: Thick Film; Construction: Rectangular; Lead Free: Lead Free; Military Standard: Not; Case Code (Metric): 2012; Mount: Surface Mount
TS11 TS41 TS42 = CMP-2000-05815-1: PCB Terminal Block, 13.5 A, 400 V, 2-Pin THD, RoHS, Bulk; Manufacturer: Phoenix Contact; Package Version: 03/2015; No. of Rows: 1; Pitch: 5.08mm; No. of Positions: 2; Voltage Rating: 400V; Current Rating: 13500mA; Manufacturer URL: http://www.phoenixcontact.com/; Datasheet URL: https://datasheet.ciiva.com/16046/1729128-16046181.pdf; RoHS: TRUE; Package URL: https://www.phoenixcontact.com/online/portal/pi/pxc/product_detail_page/!ut/p/b1/3VdJjqNKFDxLH8AFycySyWY2ozFsEPOMMQaDOX1XedGL_1Vdm5YXJleknhSKeBkvI6EA8ncAo3AYoDhBQGco6KN7VURTdemj9us_IEKEZo_YHiPAEWEFmDGOHMORkqKYCORBZxgL7ZoaZYcbFFUZ3fqxSY6GOuxydWUuHqz1ynmMFygu583Bob0Ewr6Sd_l-5m-kAueHiB0jpRwZwe58wwtkpxtMYd_LmGcDRU02dRNEyWt6Y2ti5pSyJ_reIkzIulrqApdnbT11V5jnCKbYNCvhEM1MCpPByat_X379-iThf08CI5GfOPqfBeS3BRoBOdD55AKVv0iLwCMq-2BrzXWSGRH7pUGD9uwXQjiph3xL0DKQwdGa0JImiIOmBNOestqgwTHSSs2oOep-78apyXQBvNi8ZLaFjvjWvcaUEBu0MC6Wbe-d6mB0FAebo2lUWinqYaZs5DAYzV0RP9yitUjnGJ0iI9xhZkT42OCQNUJJhkgWINNQLP2JFP6OpMg3JCVg70jqHT0lvKOnhHf0lPuOnnLf0VPuWx6_dxwUIvwk5WMkT0kLL1mh61l2yZVSzG3pYV_bqo-mj6uMKwKwdnnW8Jh5RTOJzMOA5c-eJDaZQw4mTMPH02PvS_ZAqNVjVTo2WyYLkwH_KU1mmmG5kjRhDqPXLwwVHvVOjCM60-fpXvTDfMGW1PVFVS1r4e4yVDk4ZdNbkUHvqPqQSeian4UD39fNKmachqdJ1NJbyk8rXT9mXTvPk3oE5meulKGgiruPJek-4I9hTT6G8ZLOyRSm2RRVbThERQad5OS28hdt4YW4vG0stgYYzsWsK4_7y6DZMjJSCqri1kyiZR5vD7pwIrNR7QwPHTcLTI5qT7eRlpHrdGiupYlqQDJ7zy_CND8fWWBoLRXxk1RVcXiBQwbTD4Xi7KL-FuO94t9xaqweXzH; PartNumber: 1729128; Package Description: 2-Pin Through Hole Device, Body 8.1 x 10.16 mm, Pitch 5.08 mm; Datasheet Version: 12/2013; Mounting Technology: ThroughHole; Orientation: Horizontal; Package Reference: 1729128-2; Packing: Bulk
TS11_AMP TS41_AMP TS42_AMP = CMP-05687-000002-1: IC CONV THERMOCOUPLE 14TSSOP; Manufacturer Part Number: MAX31856MUD+T; Manufacturer: Maxim Electronics; Sensor Output: SPI; Max Junction Temp: +150°C; Min Supply Voltage: 3V; Standoff Height: 0.05mm; Max Supply Voltage: 3.6V; Nominal Supply Current: 1.2mA; Automotive: No; Temperature Range Low: -55°C; Device Class L3: Sensor and Detector Interfaces; Temperature Range High: +125°C; Package: U14-2; Sensor Type String: Thermocouple; Ipc Land Pattern Name: SOP65P640X110-14; Temperature: -55°C to +125°C; Device Class L1: Integrated Circuits (ICs); ComponentLink2Description: Datasheet; Digikey Description: IC CONV THERMOCOUPLE 14TSSOP; ComponentLink2URL: https://datasheets.maximintegrated.com/en/ds/MAX31856.pdf; RoHS: TRUE; Device Class L2: Interface ICs; Octopart: https://octopart.com/max31856mud%2Bt-maxim+integrated-51261112; Interface: SPI; Lead Free: Yes; Sensor Input: Thermocouple; Footprint Url: https://pdfserv.maximintegrated.com/land_patterns/90-0113.PDF; Height: 1.1mm; Category: IC

## Sheet Pressure_sensors.SchDoc
size A; SheetNumber: 4; SheetTotal: 7
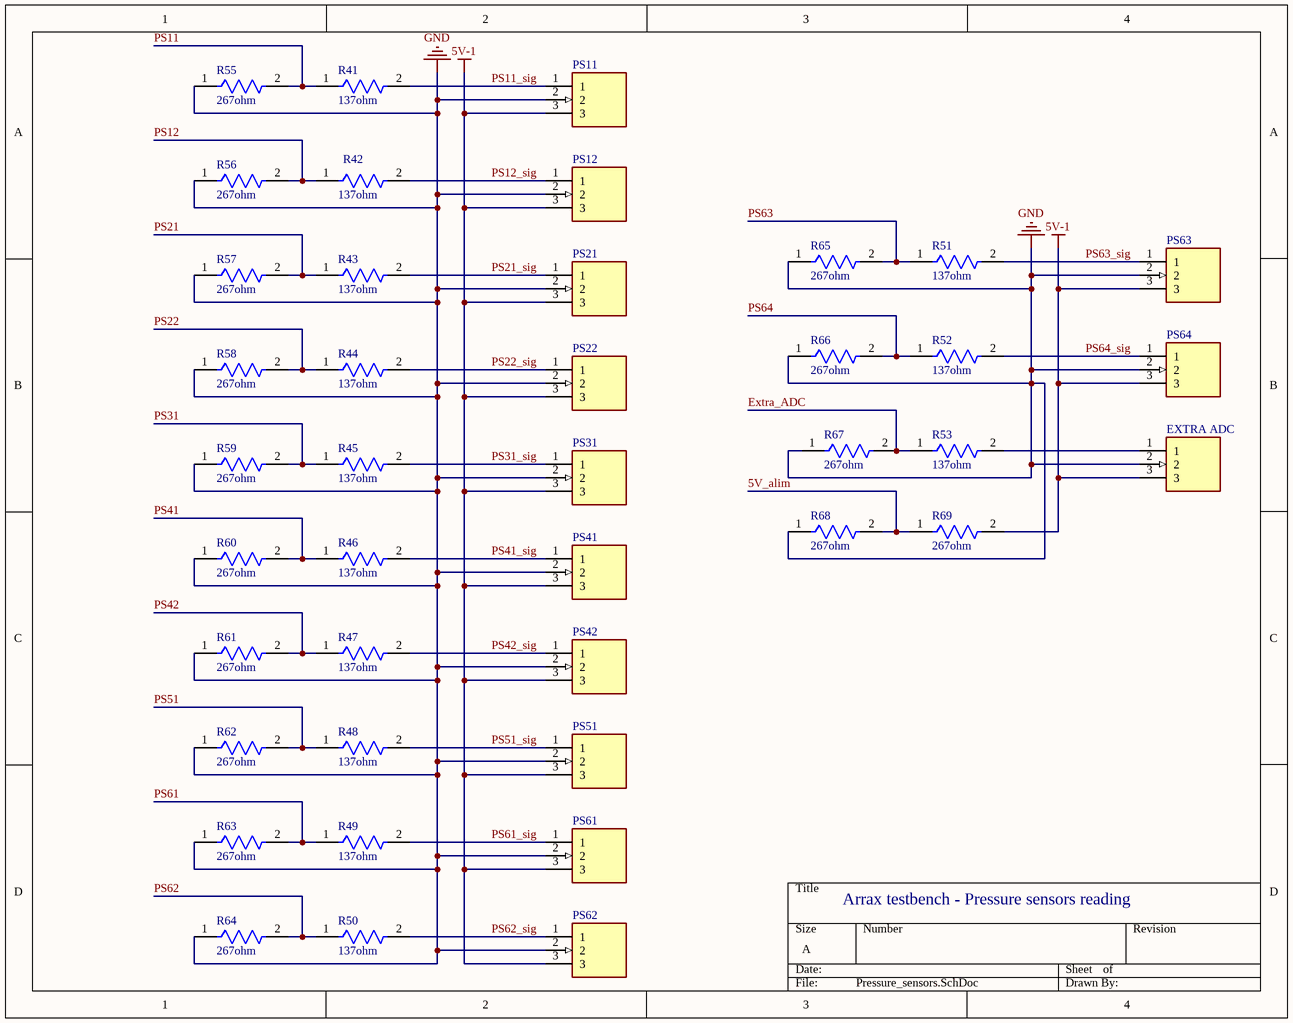
[diagram p3: Pressure_sensors.SchDoc]

### Parts
EXTRA_ADC  640456-3  [HDRV3W107P0X254_1X3_762X572X1080P]  (value not drawn)
PS11  640456-3  [HDRV3W107P0X254_1X3_762X572X1080P]  (value not drawn)
PS12  640456-3  [HDRV3W107P0X254_1X3_762X572X1080P]  (value not drawn)
PS21  640456-3  [HDRV3W107P0X254_1X3_762X572X1080P]  (value not drawn)
PS22  640456-3  [HDRV3W107P0X254_1X3_762X572X1080P]  (value not drawn)
PS31  640456-3  [HDRV3W107P0X254_1X3_762X572X1080P]  (value not drawn)
PS41  640456-3  [HDRV3W107P0X254_1X3_762X572X1080P]  (value not drawn)
PS42  640456-3  [HDRV3W107P0X254_1X3_762X572X1080P]  (value not drawn)
PS51  640456-3  [HDRV3W107P0X254_1X3_762X572X1080P]  (value not drawn)
PS61  640456-3  [HDRV3W107P0X254_1X3_762X572X1080P]  (value not drawn)
PS62  640456-3  [HDRV3W107P0X254_1X3_762X572X1080P]  (value not drawn)
PS63  640456-3  [HDRV3W107P0X254_1X3_762X572X1080P]  (value not drawn)
PS64  640456-3  [HDRV3W107P0X254_1X3_762X572X1080P]  (value not drawn)
R41  137ohm  [FP-RP73P-2A-MFG]
R42  137ohm  [FP-RP73P-2A-MFG]
R43  137ohm  [FP-RP73P-2A-MFG]
R44  137ohm  [FP-RP73P-2A-MFG]
R45  137ohm  [FP-RP73P-2A-MFG]
R46  137ohm  [FP-RP73P-2A-MFG]
R47  137ohm  [FP-RP73P-2A-MFG]
R48  137ohm  [FP-RP73P-2A-MFG]
R49  137ohm  [FP-RP73P-2A-MFG]
R50  137ohm  [FP-RP73P-2A-MFG]
R51  137ohm  [FP-RP73P-2A-MFG]
R52  137ohm  [FP-RP73P-2A-MFG]
R53  137ohm  [FP-RP73P-2A-MFG]
R55  267ohm  [FP-RP73P-2A-MFG]
R56  267ohm  [FP-RP73P-2A-MFG]
R57  267ohm  [FP-RP73P-2A-MFG]
R58  267ohm  [FP-RP73P-2A-MFG]
R59  267ohm  [FP-RP73P-2A-MFG]
R60  267ohm  [FP-RP73P-2A-MFG]
R61  267ohm  [FP-RP73P-2A-MFG]
R62  267ohm  [FP-RP73P-2A-MFG]
R63  267ohm  [FP-RP73P-2A-MFG]
R64  267ohm  [FP-RP73P-2A-MFG]
R65  267ohm  [FP-RP73P-2A-MFG]
R66  267ohm  [FP-RP73P-2A-MFG]
R67  267ohm  [FP-RP73P-2A-MFG]
R68  267ohm  [FP-RP73P-2A-MFG]
R69  267ohm  [FP-RP73P-2A-MFG]

### Nets
5V-1: EXTRA_ADC.3 PS11.3 PS12.3 PS21.3 PS22.3 PS31.3 PS41.3 PS42.3 PS51.3 PS61.3 PS62.3 PS63.3 PS64.3 R69.2
GND: EXTRA_ADC.2 PS11.2 PS12.2 PS21.2 PS22.2 PS31.2 PS41.2 PS42.2 PS51.2 PS61.2 PS62.2 PS63.2 PS64.2 R55.1 R56.1 R57.1 R58.1 R59.1 R60.1 R61.1 R62.1 R63.1 R64.1 R65.1 R66.1 R67.1 R68.1
5V_alim: R68.2 R69.1
Extra_ADC: R53.1 R67.2
PS11: R41.1 R55.2
PS11_sig: PS11.1 R41.2
PS12: R42.1 R56.2
PS12_sig: PS12.1 R42.2
PS21: R43.1 R57.2
PS21_sig: PS21.1 R43.2
PS22: R44.1 R58.2
PS22_sig: PS22.1 R44.2
PS31: R45.1 R59.2
PS31_sig: PS31.1 R45.2
PS41: R46.1 R60.2
PS41_sig: PS41.1 R46.2
PS42: R47.1 R61.2
PS42_sig: PS42.1 R47.2
PS51: R48.1 R62.2
PS51_sig: PS51.1 R48.2
PS61: R49.1 R63.2
PS61_sig: PS61.1 R49.2
PS62: R50.1 R64.2
PS62_sig: PS62.1 R50.2
PS63: R51.1 R65.2
PS63_sig: PS63.1 R51.2
PS64: R52.1 R66.2
PS64_sig: PS64.1 R52.2
NetEXTRA_ADC_1: EXTRA_ADC.1 R53.2

### Notes on the sheet
- Arrax testbench - Pressure sensors reading

### Library data of the parts
EXTRA_ADC PS11 PS12 PS21 PS22 PS31 PS41 PS42 PS51 PS61-PS64 = 640456-3: Connector; Manufacturer_Name: TE Connectivity; Datasheet Link: http://www.te.com/commerce/DocumentDelivery/DDEController?Action=showdoc&DocId=Customer+Drawing%7F640456%7FW3%7Fpdf%7FEnglish%7FENG_CD_640456_W3.pdf%7F640456-3; Height: 10.795mm; Manufacturer_Part_Number: 640456-3; Mouser Part Number: 571-6404563; Mouser Price/Stock: https://www.mouser.co.uk/ProductDetail/TE-Connectivity-AMP/640456-3?qs=%2F35zJ5USjonzBh%2Fz7jaWrQ%3D%3D; Arrow Part Number: 640456-3; Arrow Price/Stock: https://www.arrow.com/en/products/640456-3/te-connectivity?region=nac
R41-R53 = CMP-03211-001043-1: as R54 on sheet Digpot_load_cell_alim; Temperature Coefficient: 25ppm/°C; Composition: Thin Film; Temperature Range High: +155°C; Automotive: No; Ipc Land Pattern Name: RESC200125X55; Lead Free: Yes; Device Class L2: Resistors; Temperature: -55°C to +155°C; Resistance: 137Ω; Series: RP73P; Category: Res; Temperature Range Low: -55°C; RoHS: TRUE; Voltage Rating: 150V; Value: 137Ω; Height: 0.65mm; ComponentLink2URL: https://www.te.com/commerce/DocumentDelivery/DDEController?Action=srchrtrv&DocNm=1773272&DocType=DS&DocLang=English; Package: RP73P-2A; Power Rating: 0.25W; ComponentLink2Description: Datasheet; Device Class L1: Passive Components; Device Class L3: Chip SMD Resistors; Octopart: https://octopart.com/rp73pf2a137rbtdf-te+connectivity-45466427
R55-R69 = CMP-03211-003395-1: as R70 on sheet Digpot_load_cell_alim; RoHS: TRUE; Composition: Thin Film; Device Class L1: Passive Components; Temperature Coefficient: 25ppm/°C; Height: 0.65mm; Temperature Range Low: -55°C; Category: Res; Temperature Range High: +155°C; Value: 267Ω; Device Class L2: Resistors; Lead Free: Yes; ComponentLink2Description: Datasheet; ComponentLink2URL: https://www.te.com/commerce/DocumentDelivery/DDEController?Action=srchrtrv&DocNm=1773272&DocType=DS&DocLang=English; Device Class L3: Chip SMD Resistors; Voltage Rating: 150V; Power Rating: 0.25W; Automotive: No; Series: RP73P; Ipc Land Pattern Name: RESC200125X55; Package: RP73P-2A; Temperature: -55°C to +155°C; Octopart: https://octopart.com/rp73pf2a267rbtdf-te+connectivity-45466701; Resistance: 267Ω

## Sheet Valve_transistors.SchDoc
size A; SheetNumber: 5; SheetTotal: 6
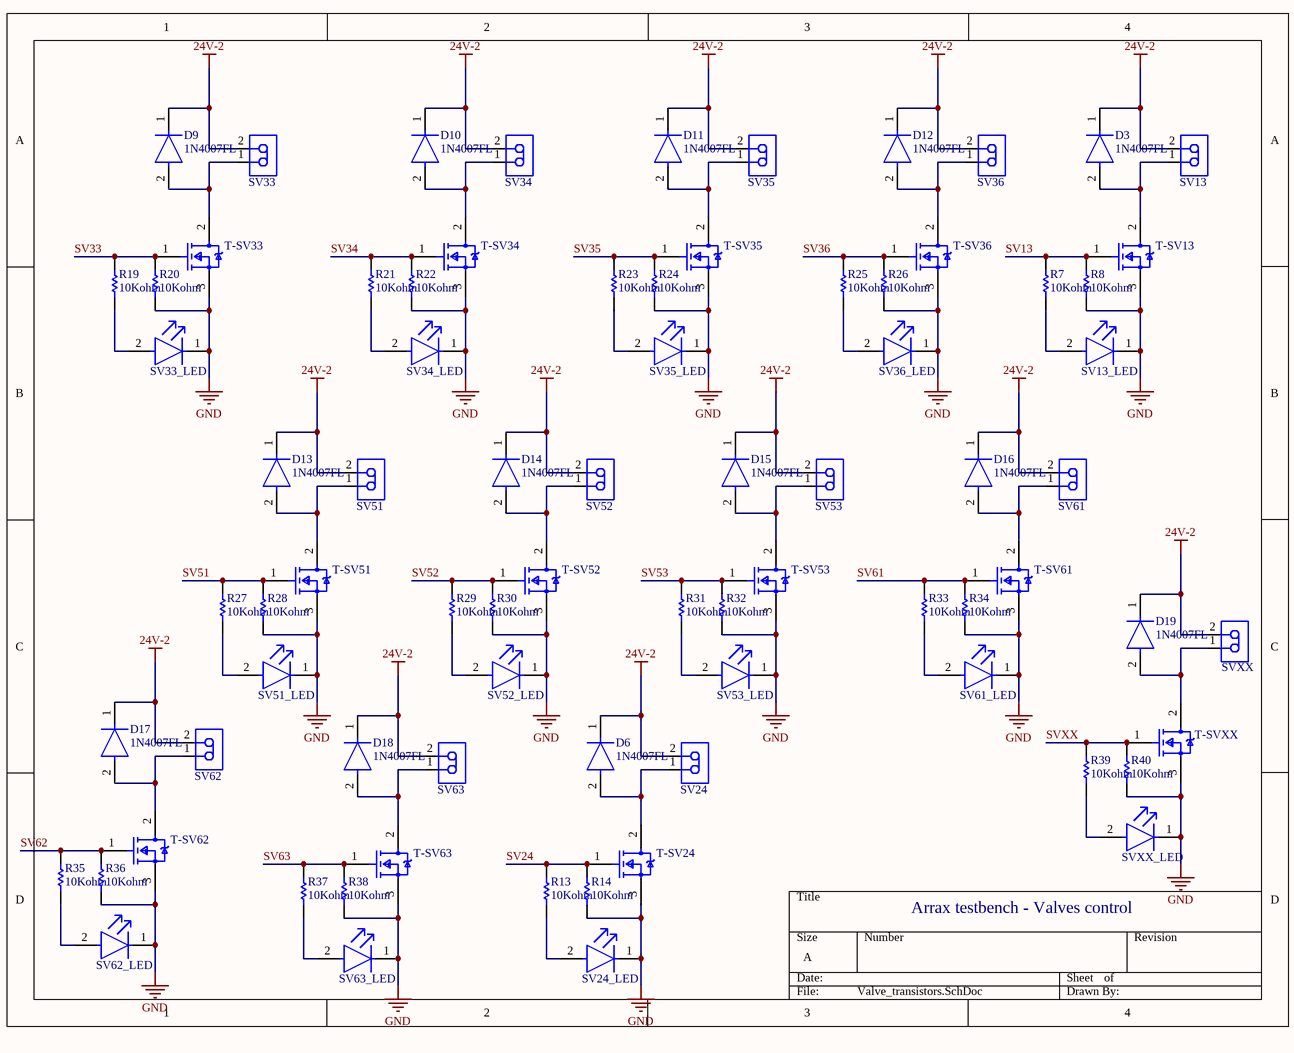
[diagram p4: Valve_transistors.SchDoc]

### Parts
D3  1N4007FL  [FP-1N4007FL-MFG]
D6  1N4007FL  [FP-1N4007FL-MFG]
D9  1N4007FL  [FP-1N4007FL-MFG]
D10  1N4007FL  [FP-1N4007FL-MFG]
D11  1N4007FL  [FP-1N4007FL-MFG]
D12  1N4007FL  [FP-1N4007FL-MFG]
D13  1N4007FL  [FP-1N4007FL-MFG]
D14  1N4007FL  [FP-1N4007FL-MFG]
D15  1N4007FL  [FP-1N4007FL-MFG]
D16  1N4007FL  [FP-1N4007FL-MFG]
D17  1N4007FL  [FP-1N4007FL-MFG]
D18  1N4007FL  [FP-1N4007FL-MFG]
D19  1N4007FL  [FP-1N4007FL-MFG]
R7  10Kohm  [RESC2013X60X30NL20T20]
R8  10Kohm  [RESC2013X60X30NL20T20]
R13  10Kohm  [RESC2013X60X30NL20T20]
R14  10Kohm  [RESC2013X60X30NL20T20]
R19  10Kohm  [RESC2013X60X30NL20T20]
R20  10Kohm  [RESC2013X60X30NL20T20]
R21  10Kohm  [RESC2013X60X30NL20T20]
R22  10Kohm  [RESC2013X60X30NL20T20]
R23  10Kohm  [RESC2013X60X30NL20T20]
R24  10Kohm  [RESC2013X60X30NL20T20]
R25  10Kohm  [RESC2013X60X30NL20T20]
R26  10Kohm  [RESC2013X60X30NL20T20]
R27  10Kohm  [RESC2013X60X30NL20T20]
R28  10Kohm  [RESC2013X60X30NL20T20]
R29  10Kohm  [RESC2013X60X30NL20T20]
R30  10Kohm  [RESC2013X60X30NL20T20]
R31  10Kohm  [RESC2013X60X30NL20T20]
R32  10Kohm  [RESC2013X60X30NL20T20]
R33  10Kohm  [RESC2013X60X30NL20T20]
R34  10Kohm  [RESC2013X60X30NL20T20]
R35  10Kohm  [RESC2013X60X30NL20T20]
R36  10Kohm  [RESC2013X60X30NL20T20]
R37  10Kohm  [RESC2013X60X30NL20T20]
R38  10Kohm  [RESC2013X60X30NL20T20]
R39  10Kohm  [RESC2013X60X30NL20T20]
R40  10Kohm  [RESC2013X60X30NL20T20]
SV13  640456-2  [TECO-640456-2_V]  (value not drawn)
SV13_LED  LS R976-NR-1  [FP-LS_R976-MFG]  (value not drawn)
SV24  640456-2  [TECO-640456-2_V]  (value not drawn)
SV24_LED  LS R976-NR-1  [FP-LS_R976-MFG]  (value not drawn)
SV33  640456-2  [TECO-640456-2_V]  (value not drawn)
SV33_LED  LS R976-NR-1  [FP-LS_R976-MFG]  (value not drawn)
SV34  640456-2  [TECO-640456-2_V]  (value not drawn)
SV34_LED  LS R976-NR-1  [FP-LS_R976-MFG]  (value not drawn)
SV35  640456-2  [TECO-640456-2_V]  (value not drawn)
SV35_LED  LS R976-NR-1  [FP-LS_R976-MFG]  (value not drawn)
SV36  640456-2  [TECO-640456-2_V]  (value not drawn)
SV36_LED  LS R976-NR-1  [FP-LS_R976-MFG]  (value not drawn)
SV51  640456-2  [TECO-640456-2_V]  (value not drawn)
SV51_LED  LS R976-NR-1  [FP-LS_R976-MFG]  (value not drawn)
SV52  640456-2  [TECO-640456-2_V]  (value not drawn)
SV52_LED  LS R976-NR-1  [FP-LS_R976-MFG]  (value not drawn)
SV53  640456-2  [TECO-640456-2_V]  (value not drawn)
SV53_LED  LS R976-NR-1  [FP-LS_R976-MFG]  (value not drawn)
SV61  640456-2  [TECO-640456-2_V]  (value not drawn)
SV61_LED  LS R976-NR-1  [FP-LS_R976-MFG]  (value not drawn)
SV62  640456-2  [TECO-640456-2_V]  (value not drawn)
SV62_LED  LS R976-NR-1  [FP-LS_R976-MFG]  (value not drawn)
SV63  640456-2  [TECO-640456-2_V]  (value not drawn)
SV63_LED  LS R976-NR-1  [FP-LS_R976-MFG]  (value not drawn)
SVXX  640456-2  [TECO-640456-2_V]  (value not drawn)
SVXX_LED  LS R976-NR-1  [FP-LS_R976-MFG]  (value not drawn)
T-SV13  IRLZ44NPbF  [FP-PG-TO220-3-MFG]  (value not drawn)
T-SV24  IRLZ44NPbF  [FP-PG-TO220-3-MFG]  (value not drawn)
T-SV33  IRLZ44NPbF  [FP-PG-TO220-3-MFG]  (value not drawn)
T-SV34  IRLZ44NPbF  [FP-PG-TO220-3-MFG]  (value not drawn)
T-SV35  IRLZ44NPbF  [FP-PG-TO220-3-MFG]  (value not drawn)
T-SV36  IRLZ44NPbF  [FP-PG-TO220-3-MFG]  (value not drawn)
T-SV51  IRLZ44NPbF  [FP-PG-TO220-3-MFG]  (value not drawn)
T-SV52  IRLZ44NPbF  [FP-PG-TO220-3-MFG]  (value not drawn)
T-SV53  IRLZ44NPbF  [FP-PG-TO220-3-MFG]  (value not drawn)
T-SV61  IRLZ44NPbF  [FP-PG-TO220-3-MFG]  (value not drawn)
T-SV62  IRLZ44NPbF  [FP-PG-TO220-3-MFG]  (value not drawn)
T-SV63  IRLZ44NPbF  [FP-PG-TO220-3-MFG]  (value not drawn)
T-SVXX  IRLZ44NPbF  [FP-PG-TO220-3-MFG]  (value not drawn)

### Nets
24V-2: D3.1(C) D6.1(C) D9.1(C) D10.1(C) D11.1(C) D12.1(C) D13.1(C) D14.1(C) D15.1(C) D16.1(C) D17.1(C) D18.1(C) D19.1(C) SV13.2 SV24.2 SV33.2 SV34.2 SV35.2 SV36.2 SV51.2 SV52.2 SV53.2 SV61.2 SV62.2 SV63.2 SVXX.2
GND: R8.1 R14.1 R20.1 R22.1 R24.1 R26.1 R28.1 R30.1 R32.1 R34.1 R36.1 R38.1 R40.1 SV13_LED.1(C) SV24_LED.1(C) SV33_LED.1(C) SV34_LED.1(C) SV35_LED.1(C) SV36_LED.1(C) SV51_LED.1(C) SV52_LED.1(C) SV53_LED.1(C) SV61_LED.1(C) SV62_LED.1(C) SV63_LED.1(C) SVXX_LED.1(C) T-SV13.3(S) T-SV24.3(S) T-SV33.3(S) T-SV34.3(S) T-SV35.3(S) T-SV36.3(S) T-SV51.3(S) T-SV52.3(S) T-SV53.3(S) T-SV61.3(S) T-SV62.3(S) T-SV63.3(S) T-SVXX.3(S)
SV13: R7.2 R8.2 T-SV13.1(G)
SV24: R13.2 R14.2 T-SV24.1(G)
SV33: R19.2 R20.2 T-SV33.1(G)
SV34: R21.2 R22.2 T-SV34.1(G)
SV35: R23.2 R24.2 T-SV35.1(G)
SV36: R25.2 R26.2 T-SV36.1(G)
SV51: R27.2 R28.2 T-SV51.1(G)
SV52: R29.2 R30.2 T-SV52.1(G)
SV53: R31.2 R32.2 T-SV53.1(G)
SV61: R33.2 R34.2 T-SV61.1(G)
SV62: R35.2 R36.2 T-SV62.1(G)
SV63: R37.2 R38.2 T-SV63.1(G)
SVXX: R39.2 R40.2 T-SVXX.1(G)
NetD3_2: D3.2(A) SV13.1 T-SV13.2(D)
NetD6_2: D6.2(A) SV24.1 T-SV24.2(D)
NetD9_2: D9.2(A) SV33.1 T-SV33.2(D)
NetD10_2: D10.2(A) SV34.1 T-SV34.2(D)
NetD11_2: D11.2(A) SV35.1 T-SV35.2(D)
NetD12_2: D12.2(A) SV36.1 T-SV36.2(D)
NetD13_2: D13.2(A) SV51.1 T-SV51.2(D)
NetD14_2: D14.2(A) SV52.1 T-SV52.2(D)
NetD15_2: D15.2(A) SV53.1 T-SV53.2(D)
NetD16_2: D16.2(A) SV61.1 T-SV61.2(D)
NetD17_2: D17.2(A) SV62.1 T-SV62.2(D)
NetD18_2: D18.2(A) SV63.1 T-SV63.2(D)
NetD19_2: D19.2(A) SVXX.1 T-SVXX.2(D)
NetR7_1: R7.1 SV13_LED.2(A)
NetR13_1: R13.1 SV24_LED.2(A)
NetR19_1: R19.1 SV33_LED.2(A)
NetR21_1: R21.1 SV34_LED.2(A)
NetR23_1: R23.1 SV35_LED.2(A)
NetR25_1: R25.1 SV36_LED.2(A)
NetR27_1: R27.1 SV51_LED.2(A)
NetR29_1: R29.1 SV52_LED.2(A)
NetR31_1: R31.1 SV53_LED.2(A)
NetR33_1: R33.1 SV61_LED.2(A)
NetR35_1: R35.1 SV62_LED.2(A)
NetR37_1: R37.1 SV63_LED.2(A)
NetR39_1: R39.1 SVXX_LED.2(A)

### Notes on the sheet
- Arrax testbench - Valves control

### Library data of the parts
D3 D6 D9-D19 = CMP-10078-122641204-1: as D1 on sheet Teensy_IOexp_valve_transitors; Reverse Voltage: 1kV; Max Operating Temperature: 150°C; Height: 1.1mm; Min Operating Temperature: -55°C; Forward Current: 1A; Max Repetitive Reverse Voltage (Vrrm): 1kV; NexarPartId: 122641204
R7 R8 R13 R14 R19-R40 = CMP-2001-01994-1: as R1 on sheet Digpot_load_cell_alim
SV13 SV24 SV33-SV36 SV51-SV53 SV61-SV63 SVXX = CMP-2000-05417-1: as Ign on sheet Digpot_load_cell_alim; Number of Rows: 1; Termination: Solder; Length, Terminal Post: 0.14 / in.; Manufacturer URL: http://www.te.com/; Color: White; Size, Post: 0.025 / in.; Contact Shape: Square; Mounting Type: PCMount; Datasheet URL: https://datasheet.ciiva.com/11746/0900766b80eb7fdd-11746365.pdf; Type: PCBPlug; Datasheet Version: Rev. W, 06/2004; Number of Contacts: 2; Flammability Rating: UL94V-0; Contact Plating: Tin; Length, Pin: 0.14 / "; Contact Mating Area Plating: Tin; Length, Overall: 0.2 / "
SV13_LED SV24_LED SV33_LED SV34_LED SV35_LED SV36_LED SV51_LED SV52_LED SV53_LED SV61_LED SV62_LED SV63_LED SVXX_LED = CMP-62016-000037-1: as Ign_LED on sheet Digpot_load_cell_alim; Length: 2mm; Number of Pins: 2; Lens Transparency: Diffused; Min Operating Temperature: -30°C; Case Code (Metric): 2012; Depth: 1.35mm; Color: Red; Illumination Color: Red; Max Operating Temperature: 85°C; Mount: Surface Mount; Case/Package: 0805; Height: 0.9mm; Package Quantity: 16000; Number of Elements: 1; Radiation Hardening: No; Case Code (Imperial): 0805; Packaging: Tape and Reel; Width: 1.25mm
T-SV13 T-SV24 T-SV33-T-SV36 T-SV51-T-SV53 T-SV61-T-SV63 T-SVXX = CMP-32901-000488-1: as T-Ign on sheet Digpot_load_cell_alim; Continuous Drain Current (ID): 47A; Case/Package: TO-220; Lead Free: Lead Free; Halogen Free: Halogen Free; Packaging: Rail/Tube; Length: 0.414inch; Min Operating Temperature: -55°C; REACH SVHC: No SVHC; Number of Pins: 3; Width: 0.185inch; Drain to Source Voltage (Vdss): 55V; Power Dissipation: 110W; RoHS Compliant: Yes; Max Operating Temperature: 175°C; Height: 0.6inch; Max Dual Supply Voltage: 55V; Drain to Source Breakdown Voltage: 55V; Mount: Through Hole